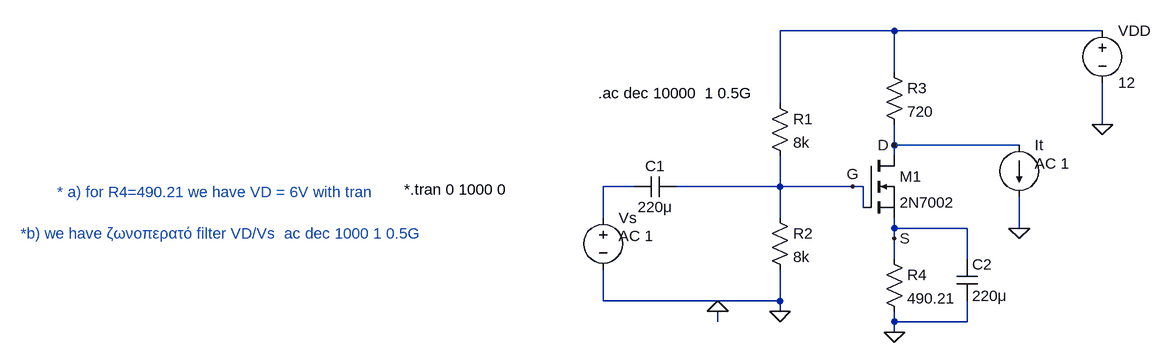
[diagram p0: schematic ask2.asc]
ask2.asc, the LTspice schematic file:
Version 4
SHEET 1 1680 680
WIRE 592 -592 416 -592
WIRE 912 -592 592 -592
WIRE 592 -528 592 -592
WIRE 416 -480 416 -592
WIRE 912 -448 912 -512
WIRE 592 -416 592 -448
WIRE 784 -416 592 -416
WIRE 592 -400 592 -416
WIRE 192 -352 144 -352
WIRE 416 -352 416 -400
WIRE 416 -352 256 -352
WIRE 528 -352 416 -352
WIRE 544 -352 528 -352
WIRE 544 -320 544 -352
WIRE 144 -304 144 -352
WIRE 416 -304 416 -352
WIRE 592 -288 592 -304
WIRE 704 -288 592 -288
WIRE 784 -288 784 -336
WIRE 592 -272 592 -288
WIRE 592 -240 592 -272
WIRE 704 -240 704 -288
WIRE 144 -176 144 -224
WIRE 416 -176 416 -224
WIRE 416 -176 144 -176
WIRE 416 -160 416 -176
WIRE 320 -144 320 -160
WIRE 592 -144 592 -160
WIRE 704 -144 704 -176
WIRE 704 -144 592 -144
WIRE 592 -128 592 -144
FLAG 416 -160 0
FLAG 912 -448 0
FLAG 592 -128 0
FLAG 528 -352 G
FLAG 592 -272 S
FLAG 592 -416 D
FLAG 320 -160 0
FLAG 784 -288 0
SYMBOL cap 256 -368 R90
WINDOW 0 0 32 VBottom 2
WINDOW 3 32 32 VTop 2
SYMATTR InstName C1
SYMATTR Value 220μ
SYMBOL res 400 -320 R0
SYMATTR InstName R2
SYMATTR Value 8k
SYMBOL res 400 -496 R0
SYMATTR InstName R1
SYMATTR Value 8k
SYMBOL voltage 912 -608 R0
SYMATTR InstName VDD
SYMATTR Value 12
SYMBOL nmos 544 -400 R0
SYMATTR InstName M1
SYMATTR Value 2N7002
SYMBOL res 576 -256 R0
SYMATTR InstName R4
SYMATTR Value 490.21
SYMBOL cap 688 -240 R0
SYMATTR InstName C2
SYMATTR Value 220μ
SYMBOL res 576 -544 R0
SYMATTR InstName R3
SYMATTR Value 720
SYMBOL voltage 144 -320 R0
WINDOW 3 24 96 Invisible 2
WINDOW 123 24 44 Left 2
WINDOW 39 0 0 Left 0
SYMATTR Value 0
SYMATTR Value2 AC 1
SYMATTR InstName Vs
SYMBOL current 784 -416 R0
WINDOW 3 24 80 Invisible 2
WINDOW 123 24 28 Left 2
WINDOW 39 0 0 Left 0
SYMATTR Value 0
SYMATTR Value2 AC 1
SYMATTR InstName It
TEXT 136 -496 Left 2 !.ac dec 10000  1 0.5G
TEXT -696 -344 Left 2 ;* a) for R4=490.21 we have VD = 6V with tran
TEXT -752 -280 Left 2 ;*b) we have ζωνοπερατό filter VD/Vs  ac dec 1000 1 0.5G
TEXT -162 -348 Left 2 !*.tran 0 1000 0

The netlist it stands for:
* ask2.asc
C1 G N002 220μ
R2 G 0 8k
R1 N001 G 8k
VDD N001 0 12
M1 D G S S 2N7002
R4 S 0 490.21
C2 S 0 220μ
R3 N001 D 720
Vs N002 0 0 AC 1
It D 0 0 AC 1
.model NMOS NMOS
.model PMOS PMOS
.lib standard.mos
.ac dec 10000  1 0.5G
* * a) for R4=490.21 we have VD = 6V with tran
* *b) we have ζωνοπερατό filter VD/Vs  ac dec 1000 1 0.5G
*.tran 0 1000 0
.backanno
.end